# Altium schematic sheet driver.SchDoc
size A
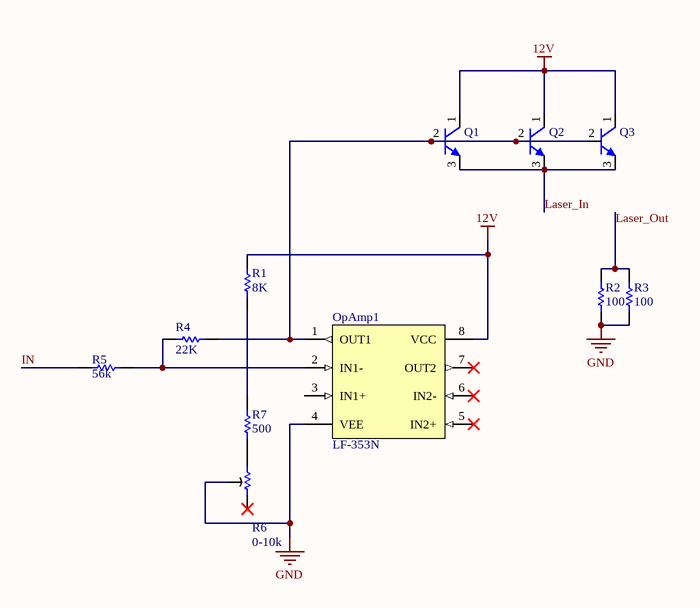
[diagram p0: driver.SchDoc]

## Parts
OpAmp1  LF-353N  [6 pin socket]
Q1  (no value)  [NPN socket]
Q2  (no value)  [NPN socket]
Q3  (no value)  [NPN socket]
R1  value 8K  [SMT 0805 (2012)]  (hidden comment: Resistor 22K 0804)
R2  value 100  [SMT 0805 (2012)]  (hidden comment: Resistor 22K 0804)
R3  value 100  [SMT 0805 (2012)]  (hidden comment: Resistor 22K 0804)
R4  value 22K  [SMT 0805 (2012)]  (hidden comment: Resistor 22K 0804)
R5  value 56k  [SMT 0805 (2012)]  (hidden comment: Resistor 56K Ohm)
R6  value 0-10k  [pot socket]  (hidden comment: 10K pot)
R7  value 500  [SMT 0805 (2012)]  (hidden comment: Resistor 500 0804)

## Nets
12V: OpAmp1.8(VCC) Q1.1 Q2.1 Q3.1 R1.1
GND: OpAmp1.4(VEE) R2.2 R3.2 R6.2
IN: R5.2
Laser_In: Q1.3 Q2.3 Q3.3
Laser_Out: R2.1 R3.1
NetOpAmp1_1: OpAmp1.1(OUT1) Q1.2 Q2.2 Q3.2 R4.2
NetOpAmp1_2: OpAmp1.2(IN1-) R4.1 R5.1
NetR1_2: R1.2 R7.1
NetR6_1: R6.1 R7.2

Not connected (* = marked no-connect by the designer): OpAmp1 3(IN1+) 5(IN2+)* 6(IN2-)* 7(OUT2)*; R6 3*

## Library data of the parts
OpAmp1 = LF353NFS-ND
Q1-Q3 = MMBT3904: NPN Bipolar Transistor; PackageReference: TO-226; Supplier 1: Digi-Key; Supplier Part Number 1: MMBT3904FSCT-ND
R1-R4 R7 = Resistor 22K 0804: Resistor 22K 1% Surface Mount 0804; Power: 100 mW
R5 = Resistor 56k Ohm 0804: Resistor 56K 0804
R6 = 10K pot: Power: 100 mW